# EAGLE design clock_circ (EAGLE 7.1.0)
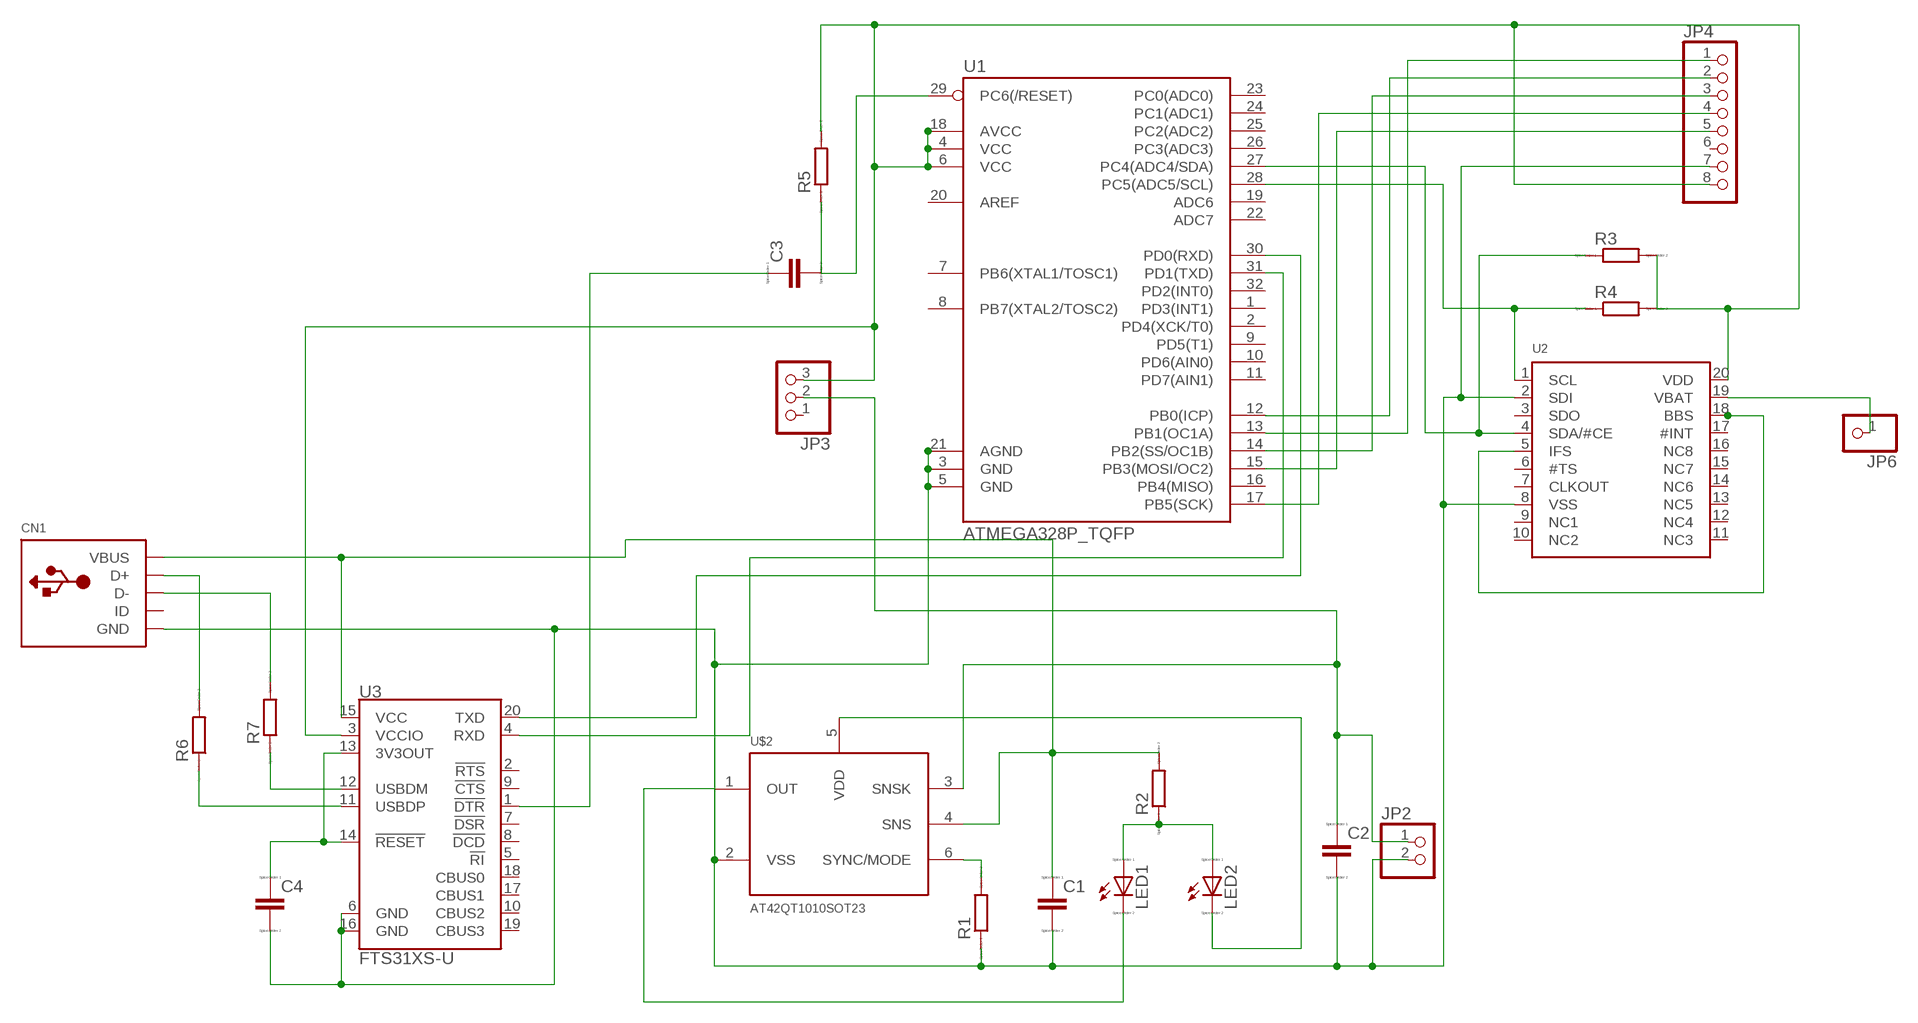
[diagram p0: schematic, sheet 1]

## Parts
C1  CC1005  [C1005]
C2  CC1005  [C1005]
C3  CC0603  [C0603]
C4  CC1005  [C1005]
CN1  USBMINIB  [USB-MINIB]
JP2  PINHD-1X2  [1X02]
JP3  PINHD-1X3  [1X03]
JP4  HEADER-1X8  [1X08_OVAL]
JP6  PINHD-1X1  [1X01]
LED1  LED_E  [LED_1206]
LED2  LED_E  [LED_1206]
R1  RR0603  [R0603]
R2  RR0603  [R0603]
R3  RR0603  [R0603]
R4  RR0603  [R0603]
R5  RR0603  [R0603]
R6  RR0603  [R0603]
R7  RR0603  [R0603]
U1  ATMEGA328P_TQFP  [TQFP32-08]
U2  RTC_PCF2129A  [SOIC20WIDE]
U3  FTS31XS-U  FT231XS  [SSOP20_L]
U$2  AT42QT1010SOT23  [SOT23-6]

## Nets
N$1: LED1.A LED2.A R2.1
N$2: LED1.C U$2.1(OUT)
N$3: LED2.C U$2.5(VDD)
N$4: JP3.3 JP4.8 R3.2 R4.2 R5.2 U1.4(VCC) U1.6(VCC) U1.18(AVCC) U2.20(VDD) U3.3(VCCIO)
N$6: JP4.1 U1.13(PB1(OC1A))
N$7: R1.2 U$2.6(SYNC/MODE)
N$8: JP6.1 U2.19(VBAT)
N$9: C2.1 JP2.1 JP3.2 U$2.3(SNSK)
N$10: R4.1 U1.28(PC5(ADC5/SCL)) U2.1(SCL)
N$11: R3.1 U1.27(PC4(ADC4/SDA)) U2.4(SDA/#CE)
N$12: JP4.5 U1.15(PB3(MOSI/OC2))
N$13: U2.5(IFS) U2.18(BBS)
N$14: C1.1 CN1.VBUS R2.2 U3.15(VCC) U$2.4(SNS)
N$15: JP4.4 U1.17(PB5(SCK))
N$16: CN1.D+ R6.2
N$17: C3.1 U3.1(!DTR)
N$18: C3.2 R5.1 U1.29(PC6(/RESET))
N$20: U1.31(PD1(TXD)) U3.4(RXD)
N$21: U1.30(PD0(RXD)) U3.20(TXD)
N$30: C4.1 U3.13(3V3OUT) U3.14(!RESET)
N$31: JP4.2 U1.12(PB0(ICP))
N$32: JP4.3 U1.14(PB2(SS/OC1B))
N$33: CN1.D- R7.2
N$34: R7.1 U3.12(USBDM)
N$36: R6.1 U3.11(USBDP)
N$38: C1.2 C2.2 C4.2 CN1.GND JP2.2 JP4.7 R1.1 U1.3(GND) U1.5(GND) U1.21(AGND) U2.2(SDI) U2.8(VSS) U3.6(GND) U3.16(GND) U$2.2(VSS)
Unconnected: CN1.ID JP3.1 JP4.6 U1.1(PD3(INT1)) U1.2(PD4(XCK/T0)) U1.7(PB6(XTAL1/TOSC1)) U1.8(PB7(XTAL2/TOSC2)) U1.9(PD5(T1)) U1.10(PD6(AIN0)) U1.11(PD7(AIN1)) U1.16(PB4(MISO)) U1.19(ADC6) U1.20(AREF) U1.22(ADC7) U1.23(PC0(ADC0)) U1.24(PC1(ADC1)) U1.25(PC2(ADC2)) U1.26(PC3(ADC3)) U1.32(PD2(INT0)) U2.3(SDO) U2.6(#TS) U2.7(CLKOUT) U2.9(NC1) U2.10(NC2) U2.11(NC3) U2.12(NC4) U2.13(NC5) U2.14(NC6) U2.15(NC7) U2.16(NC8) U2.17(#INT) U3.2(!RTS) U3.5(!RI) U3.7(!DSR) U3.8(!DCD) U3.9(!CTS) U3.10(CBUS2) U3.17(CBUS1) U3.18(CBUS0) U3.19(CBUS3)

## Library data of the parts
C1-C4 = eagle-ltspice:C: CAPACITOR, European symbol; SPICEMODEL: NONE; SPICEPREFIX: C
CN1 = OLED_mod:USB: USB Connectors USBMINIB - Surface Mount Female Mini-B USB Connector 4UConnector: 06564
JP2 = pinhead:PINHD-1X2: PIN HEADER
JP3 = pinhead:PINHD-1X3: PIN HEADER
JP4 = OLED_mod:HEADER-1X8: PIN HEADER
JP6 = pinhead:PINHD-1X1: PIN HEADER
LED1 LED2 = eagle-ltspice:LED_E: LED Source: http://www.osram.convergy.de Source: www.luxeon.com Source: www.kingbright.com; SPICEMODEL: NONE; SPICEPREFIX: D; SPICETYPE: diode
R1-R7 = eagle-ltspice:R: RESISTOR, European symbol; SPICEMODEL: NONE; SPICEPREFIX: R
U1 = SparkFun-DigitalIC:ATMEGA328P_TQFP; PROD_ID: IC-09069
U2 = microbuilder:RTC_PCF2129A: PCF2120A - High Accuracy, Temp Compensated RTC with Integrated Crystal Digikey: 568-4960-5-ND; PARTNO: PCF2129AT/1,512
U3 = SparkFun-DigitalIC:FT231X: FTDI FT231X Full Speed USB to Full-handshake UART This USB2.0 Full Speed IC offers a compact bridge to full handshake UART interfaces. The device is a UART, capable of operating up to 3MBaud, with low power consumption (8mA). The FT231X includes the complete FT-X series feature set and enables USB to be added into a system design quickly and easily over a UART interface.; PROD_ID: IC-11524
U$2 = SparkFun-DigitalIC:AT42QT1010

## Board
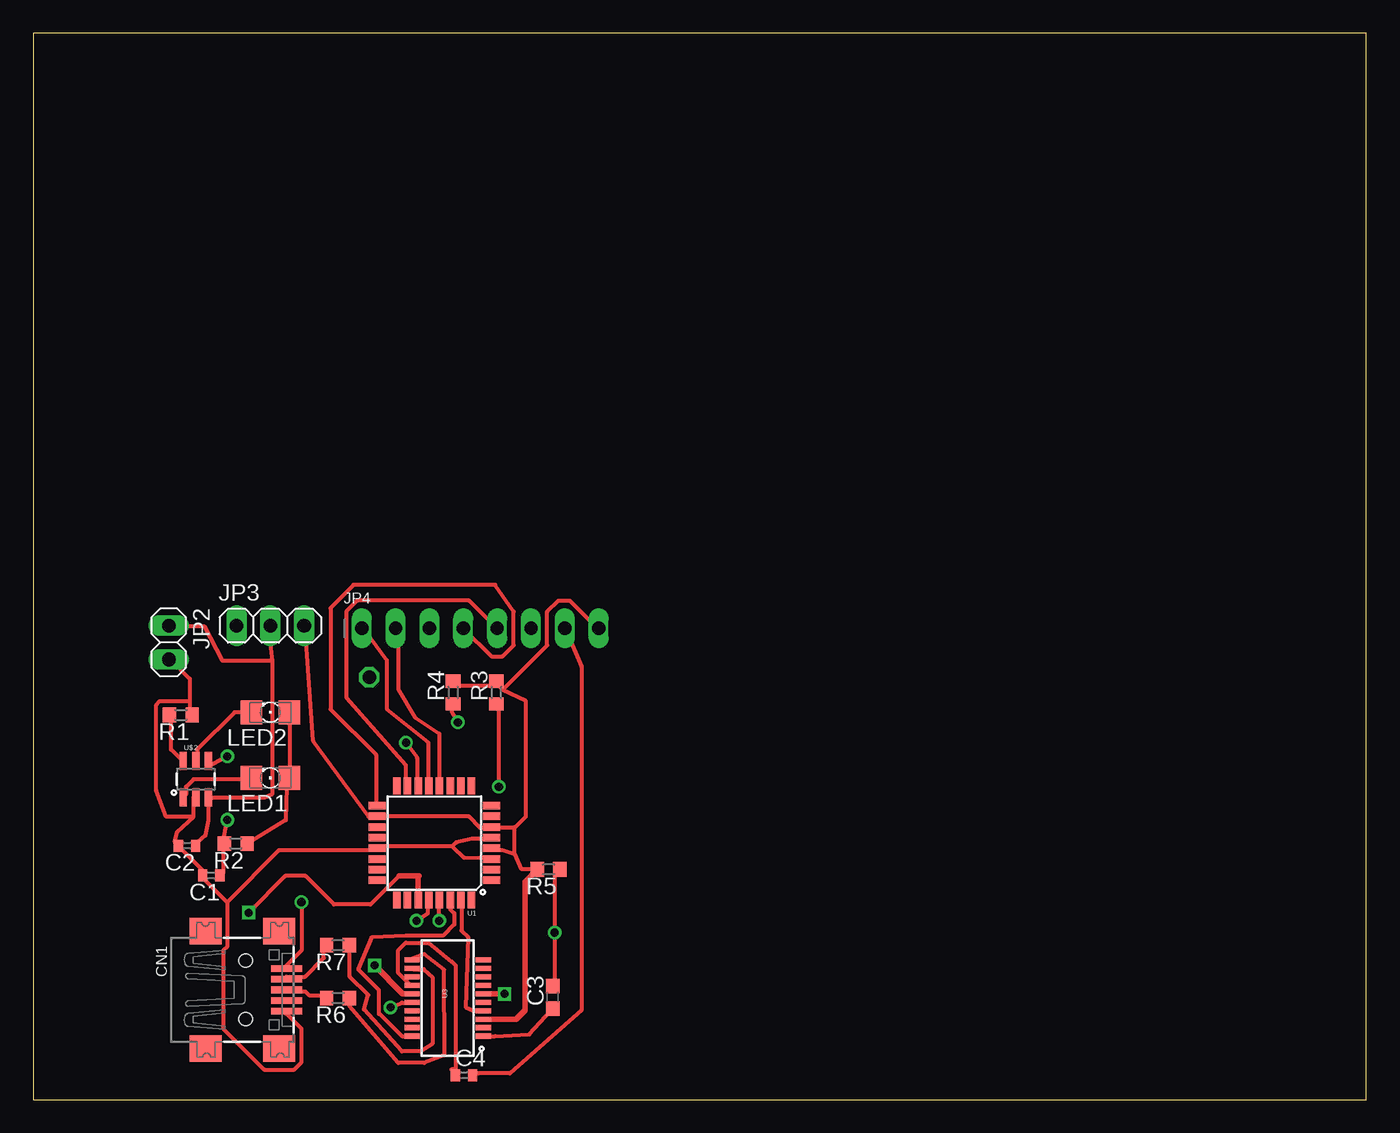
[diagram p1: board, top side]
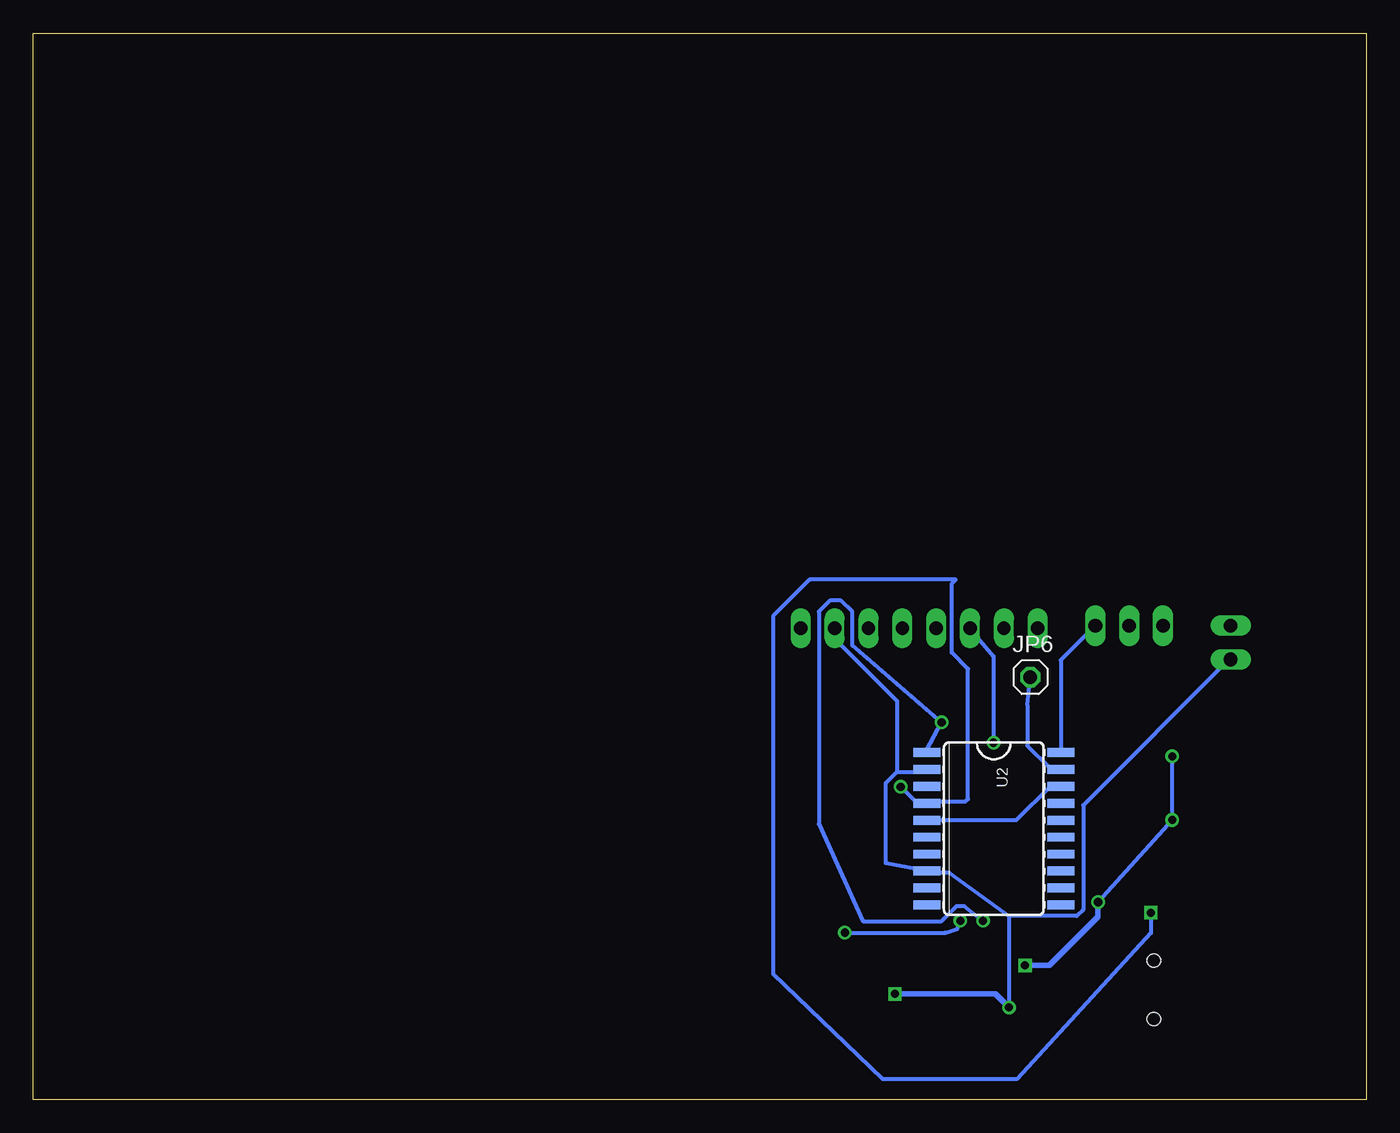
[diagram p2: board, bottom side, seen from below]

Size 100 x 80 mm. Coordinates in mm from the lower left corner, seen from the top.
Outline: 0,0 100,0 100,80 0,80 0,0
Copper layers (1*16): Top 0.035mm / dielectric 1.5mm / Bottom 0.035mm
Design rules "default *": minimum track width 12mil, minimum drill 24mil, track to track 10mil, track to pad 8mil, pad to pad 8mil, via to via 8mil, smd to smd 8mil, copper to edge 40mil, drill to drill 8mil, minimum pad ring 10mil, minimum via ring 8mil, stop-mask expansion 4mil, vias tented up to drill 0mil, thermal gap 10mil
vRestrict: area 10.4,4.3 to 19.5,12.2; area 10.7,23.2 to 13.7,25; area 24.1,14 to 31.7,26.8; area 26.5,15.8 to 33.5,22.9

### Footprints (pad centres in the part's own frame; a part is rotated, then mirrored left to right if it is on the bottom)
C1005 = smd 0.7 x 0.9: 1 -0.65,0; 2 0.65,0
C0603 = smd 1.1 x 1: 1 -0.85,0; 2 0.85,0
USB-MINIB = smd 0.5 x 2.308: D+ 0,4.064; D- -0.8,4.064; GND 1.6,4.064; ID 0.8,4.064; VBUS -1.6,4.064 | smd 2 x 2.4: GND1 -4.4,-2; GND2 -4.4,3.5; GND3 4.4,3.5; GND4 4.4,-2 | hole 1: -2.2,1; 2.2,1
1X02 = drill 1.016 long: 1 -1.27,0; 2 1.27,0
1X03 = drill 1.016 long: 1 -2.54,0; 2 0,0; 3 2.54,0
1X08_OVAL = drill 1 long: 1 -8.89,0; 2 -6.35,0; 3 -3.81,0; 4 -1.27,0; 5 1.27,0; 6 3.81,0; 7 6.35,0; 8 8.89,0
1X01 = drill 1.016 octagon: 1 0,0
LED_1206 = smd 1.6 x 1.803: A -1.422,0; C 1.422,0
R0603 = smd 1 x 1.1: 1 -0.85,0; 2 0.85,0
TQFP32-08 = smd 1.27 x 0.559: 1 -4.293,2.8; 2 -4.293,2; 3 -4.293,1.2; 4 -4.293,0.4; 5 -4.293,-0.4; 6 -4.293,-1.2; 7 -4.293,-2; 8 -4.293,-2.8; 17 4.293,-2.8; 18 4.293,-2; 19 4.293,-1.2; 20 4.293,-0.4; 21 4.293,0.4; 22 4.293,1.2; 23 4.293,2; 24 4.293,2.8 | smd 0.559 x 1.27: 9 -2.8,-4.293; 10 -2,-4.293; 11 -1.2,-4.293; 12 -0.4,-4.293; 13 0.4,-4.293; 14 1.2,-4.293; 15 2,-4.293; 16 2.8,-4.293; 25 2.8,4.293; 26 2,4.293; 27 1.2,4.293; 28 0.4,4.293; 29 -0.4,4.293; 30 -1.2,4.293; 31 -2,4.293; 32 -2.8,4.293
SOIC20WIDE = smd 0.66 x 2.032: 1 -5.715,-5.029; 2 -4.445,-5.029; 3 -3.175,-5.029; 4 -1.905,-5.029; 5 -0.635,-5.029; 6 0.635,-5.029; 7 1.905,-5.029; 8 3.175,-5.029; 9 4.445,-5.029; 10 5.715,-5.029; 11 5.715,5.029; 12 4.445,5.029; 13 3.175,5.029; 14 1.905,5.029; 15 0.635,5.029; 16 -0.635,5.029; 17 -1.905,5.029; 18 -3.175,5.029; 19 -4.445,5.029; 20 -5.715,5.029
SSOP20_L = smd 0.381 x 1.143: 1 -2.857,-2.68; 2 -2.223,-2.68; 3 -1.587,-2.68; 4 -0.953,-2.68; 5 -0.318,-2.68; 6 0.318,-2.68; 7 0.953,-2.68; 8 1.587,-2.68; 9 2.223,-2.68; 10 2.857,-2.68; 11 2.857,2.68; 12 2.223,2.68; 13 1.587,2.68; 14 0.953,2.68; 15 0.318,2.68; 16 -0.318,2.68; 17 -0.953,2.68; 18 -1.587,2.68; 19 -2.223,2.68; 20 -2.857,2.68
SOT23-6 = smd 0.55 x 1.35: 1 -0.95,-1.375; 2 0,-1.375; 3 0.95,-1.375; 4 0.95,1.375; 5 0,1.375; 6 -0.95,1.375

### Placement (x,y rotation side)
C1  13.36,16.81 180 top
C2  11.53,19.05 180 top
C3  38.96,7.67 90 top
C4  32.31,1.83 0 top
CN1  14.94,8.23 270 top
JP2  10.16,34.29 270 top
JP3  17.78,35.56 0 top
JP4  33.53,35.36 0 top
JP6  25.2,31.7 0 bottom
LED1  17.78,24.13 180 top
LED2  17.78,29.06 180 top
R1  11.07,28.85 180 top
R2  15.19,19.2 180 top
R3  34.75,30.53 90 top
R4  31.5,30.53 90 top
R5  38.66,17.27 180 top
R6  22.86,7.62 180 top
R7  22.86,11.58 180 top
U1  30.07,19.25 180 top
U2  27.94,20.32 270 bottom
U3  31.09,7.62 90 top
U$2  12.19,24.03 0 top

### Tracks (layer width: path | path; a pad name or v marks a point on that pad's centre or on a via)
N$1
  Top 0.305: R2.1 16.2,19.28 18.95,20.98 19,23.47 19,24.03 LED1.A 19.28,24.31 19.28,29.06 LED2.A
N$2
  Top 0.305: U$2.1 11.46,22.91 11.46,23.47 12.01,24.03 16.2,24.03 LED1.C
N$3
  Top 0.305: LED2.C 15.09,29.06 12.29,26.26 12.29,25.43 U$2.5
N$4
  Top 0.305: R4.2 31.42,31.01 34.65,31.01 R3.2 | 36.09,18.44 35.2,18.72 34.37,18.72 U1.4 | 36.09,18.44 36.6,17.32 37.72,17.32 R5.2 | 36.12,20.4 34.37,20.4 | 36.12,20.4 36.09,20.42 36.09,18.44 | 34.37,20.4 33.53,20.4 32.69,21.23 25.98,21.23 U1.18 25.7,21.23 25.15,21.23 21.01,26.9 20.4,35.48 JP3.3 | 34.37,20.4 U1.6 | 35.2,30.73 36.96,29.9 36.96,21.23 36.12,20.4 | 35.2,30.73 34.92,31.01 R3.2 | 35.2,30.73 38.56,34.09 38.56,36.6 39.4,37.44 40.23,37.44 42.19,35.48 JP4.8 | 35.2,30.73 R3.2
  Top 0.406: U3.3 36.21,6.03 36.88,6.71 36.88,16.34 R5.2
  Bottom 0.305: U2.20 22.91,32.97 JP3.3
N$6
  Top 0.305: U1.13 29.62,23.75 29.62,26.82 26.52,29.31 26.52,32.94 24.87,35.2 JP4.1
N$7
  Top 0.305: R1.2 10.34,28.78 10.34,26.26 11.18,25.43 U$2.6
N$8
  Bottom 0.305: U2.19 22.91,24.87 23.75,24.87 25.43,26.54 25.43,29.62 JP6.1
N$9
  Top 0.305: C2.1 12.29,19.28 12.9,19.81 13.13,20.95 13.13,22.63 U$2.3 13.41,22.63 17.32,22.63 17.91,22.91 17.91,32.92 | 17.91,32.92 17.6,35.48 JP3.2 | 17.91,32.92 14.2,32.92 12.85,35.48 10.34,35.48 JP2.1
N$10  (via drill 0.61)
  Top 0.305: v31.85,28.3 31.42,29.03 R4.1 | v28.75,13.41 29.62,13.97 29.62,14.81 U1.28
  Bottom 0.305: U2.1 32.97,26.26 v31.85,28.3 38.56,34.09 38.56,36.6 39.4,37.44 40.23,37.44 41.07,36.6 41.07,20.68 37.74,13.39 31.85,13.39 30.71,14.53 30.18,14.53 v28.75,13.41
N$11  (via drill 0.6, 0.61)
  Top 0.305: v34.92,23.47 34.92,29.34 R3.1 | 27.43,16.76 25.3,14.63 22.55,14.63 20.42,16.76 18.9,16.76 v16.15,14.02
  Top 0.406: U1.27 28.87,16.68 28.96,16.76 27.43,16.76
  Bottom 0.305: v34.92,23.47 33.81,22.35 32.97,22.35 | 32.97,22.35 U2.4 | v16.15,14.02 16.15,12.5 26.21,1.52 36.27,1.52 44.5,9.45 44.5,36.27 41.76,39.01 30.79,39.01 31.09,38.71 31.09,33.53 29.87,32.31 29.87,22.55 30.07,22.35 32.97,22.35
N$12
  Top 0.305: U1.15 27.94,23.75 27.94,25.09 23.47,30.18 23.47,36.6 24.31,37.44 32.69,37.44 34.65,35.48 JP4.5
N$13
  Bottom 0.305: U2.5 26.26,20.95 23.75,23.47 22.91,23.47 U2.18
N$14  (via drill 0.6, 0.61)
  Top 0.305: C1.1 14.25,17.04 14.25,19 R2.2 14.25,19.28 v14.55,20.98 | v14.55,25.76 13.41,25.15 U$2.4 | v20.12,14.81 20.12,11.18 19,10.06 CN1.VBUS
  Top 0.406: U3.15 27.72,7.94 v25.6,10.06
  Bottom 0.305: v14.55,25.76 v14.55,20.98 v20.12,14.81
  Bottom 0.406: v25.6,10.06 23.77,10.06 20.12,13.72 v20.12,14.81
N$15
  Top 0.305: JP4.4 34.37,33.25 35.2,33.25 36.04,34.09 36.04,36.6 34.65,38.61 24.03,38.61 22.3,36.88 22.3,29.29 25.7,25.88 25.7,22.07 U1.17
N$16
  Top 0.305: R6.2 21.79,7.82 20.68,7.82 20.4,8.1 19,8.1 CN1.D+
N$17
  Top 0.305: C3.1 38.84,6.71 37.21,4.88 34.65,4.75 33.81,4.75 U3.1
N$18  (via drill 0.61)
  Top 0.305: C3.2 39.12,8.66 v39.12,12.52 39.12,16.76 39.4,17.04 R5.1 | v30.45,13.41 30.45,14.81 U1.29
  Bottom 0.305: v30.45,13.41 30.68,12.8 31.57,12.52 v39.12,12.52
N$20
  Top 0.305: U3.4 33.53,6.71 32.97,6.71 32.44,6.93 32.61,12.19 32.13,12.68 32.13,14.81 U1.31
N$21
  Top 0.305: U3.20 28.22,4.75 27.66,4.75 25.98,6.43 25.91,6.43 25.91,8.23 24.38,9.75 25.38,12.17 27.94,12.29 30.73,12.29 31.57,13.13 31.57,13.97 31.29,14.25 31.29,14.81 U1.30
N$30
  Top 0.305: 27.94,8.94 28.22,8.66 U3.14 | 27.94,8.94 27.38,9.5 27.38,11.2 27.94,11.76 29.64,11.76 31.37,10.34 31.39,10.36 31.7,10.06 31.7,2.13 31.57,2.26 31.37,2.26 C4.1 | 27.94,8.94 28.22,9.22 U3.13
N$31
  Top 0.305: U1.12 30.45,23.75 30.45,27.46 28.65,28.65 27.38,30.81 27.38,35.2 JP4.2
N$32  (via drill 0.61)
  Top 0.305: v27.96,26.77 28.78,25.65 28.78,23.75 U1.14
  Bottom 0.305: v27.96,26.77 27.96,33.25 29.62,35.2 JP4.3
N$33
  Top 0.305: R7.2 21.79,11.46 21.79,10.62 20.4,9.22 19,9.22 CN1.D-
N$34
  Top 0.305: R7.1 23.75,11.46 23.75,9.22 25.12,7.85 24.82,6.76 27.66,3.61 29.06,3.61 29.95,4.19 29.95,9.17 29.29,9.78 29.26,9.75 28.5,9.78 U3.12
N$36
  Top 0.305: R6.1 23.75,7.54 23.75,6.99 27.38,2.74 29.34,2.74 30.81,3.3 30.79,9.75 30.81,9.73 30.81,9.75 29.34,10.92 28.5,10.62 U3.11
N$38  (via drill 0.6, 0.61)
  Top 0.305: v26.8,6.91 27.66,7.26 28.22,7.26 U3.16 | C4.2 33.38,1.96 35.76,1.96 41.12,6.71 41.12,32.51 39.95,35.2 JP4.7 | 31.42,19 31.73,19.28 32.92,19.56 34.37,19.56 U1.5 | 31.42,19 32.33,18.14 33.53,18.16 34.37,18.16 U1.3 | 31.42,19 25.98,19 U1.21 25.7,18.72 18.44,18.72 14.53,14.81 | 11.73,29.9 11.73,31.57 10.34,32.97 JP2.2 | 11.73,29.9 11.73,29.06 R1.1 | 12.01,21.21 10.79,20.07 10.62,19.28 C2.2 10.9,19 12.85,17.04 C1.2 12.57,16.76 14.53,14.81 | 12.01,21.21 12.01,22.63 U$2.2 | 14.53,14.81 14.53,11.46 14.25,11.18 14.25,5.31 17.32,2.23 19.56,2.23 20.12,2.79 20.12,5.31 19,6.43 CN1.GND | 11.73,29.9 9.5,29.9 9.22,29.62 9.22,23.19 9.98,21.21 12.01,21.21
  Top 0.406: U3.6 35.04,7.94 v35.36,7.92
  Bottom 0.305: 26.8,13.77 v26.8,6.91 | 26.8,13.77 31.29,17.04 32.97,17.04 U2.8 32.97,17.32 33.81,17.32 36.04,17.73 36.04,23.75 35.2,24.59 | 35.2,24.59 32.97,24.59 U2.2 | 35.2,24.59 35.2,29.9 39.67,34.37 39.67,35.2 JP4.7 | 26.8,13.77 21.72,13.77 21.23,14.25 21.23,22.07 10.34,32.97 JP2.2
  Bottom 0.406: v35.36,7.92 27.81,7.92 v26.8,6.91